# Altium project ME-TT-033.PrjPcb
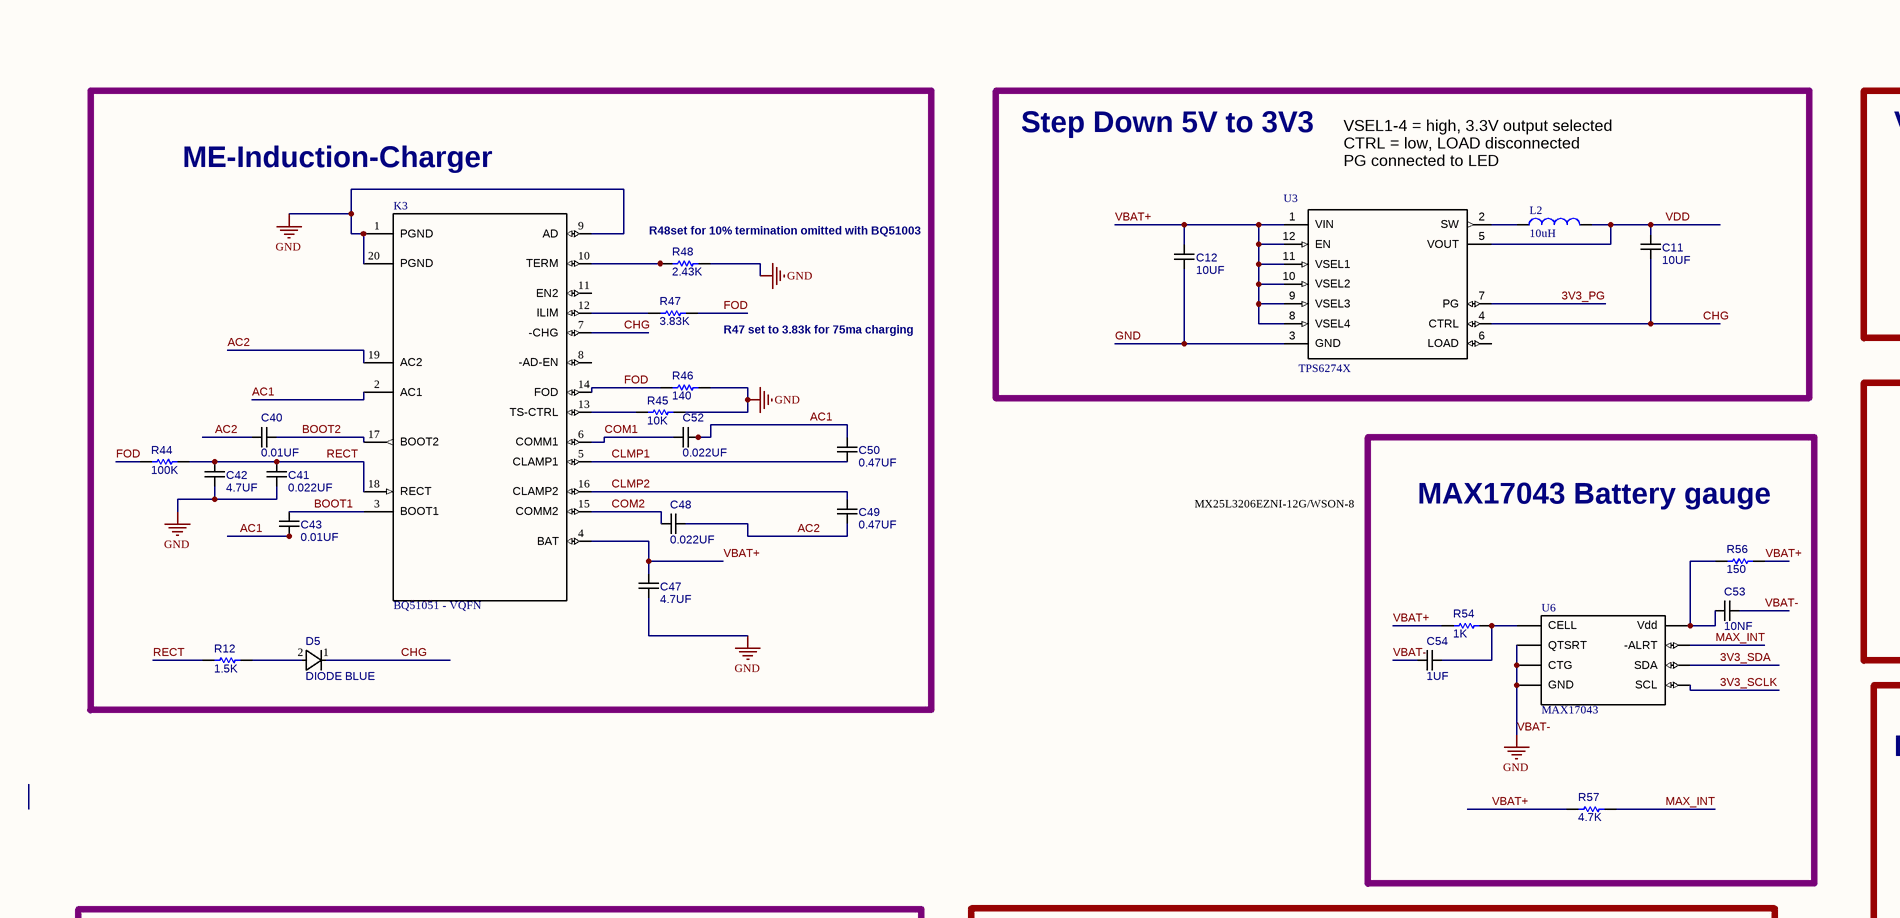
[diagram p0: Flytta-33.SchDoc, top left]
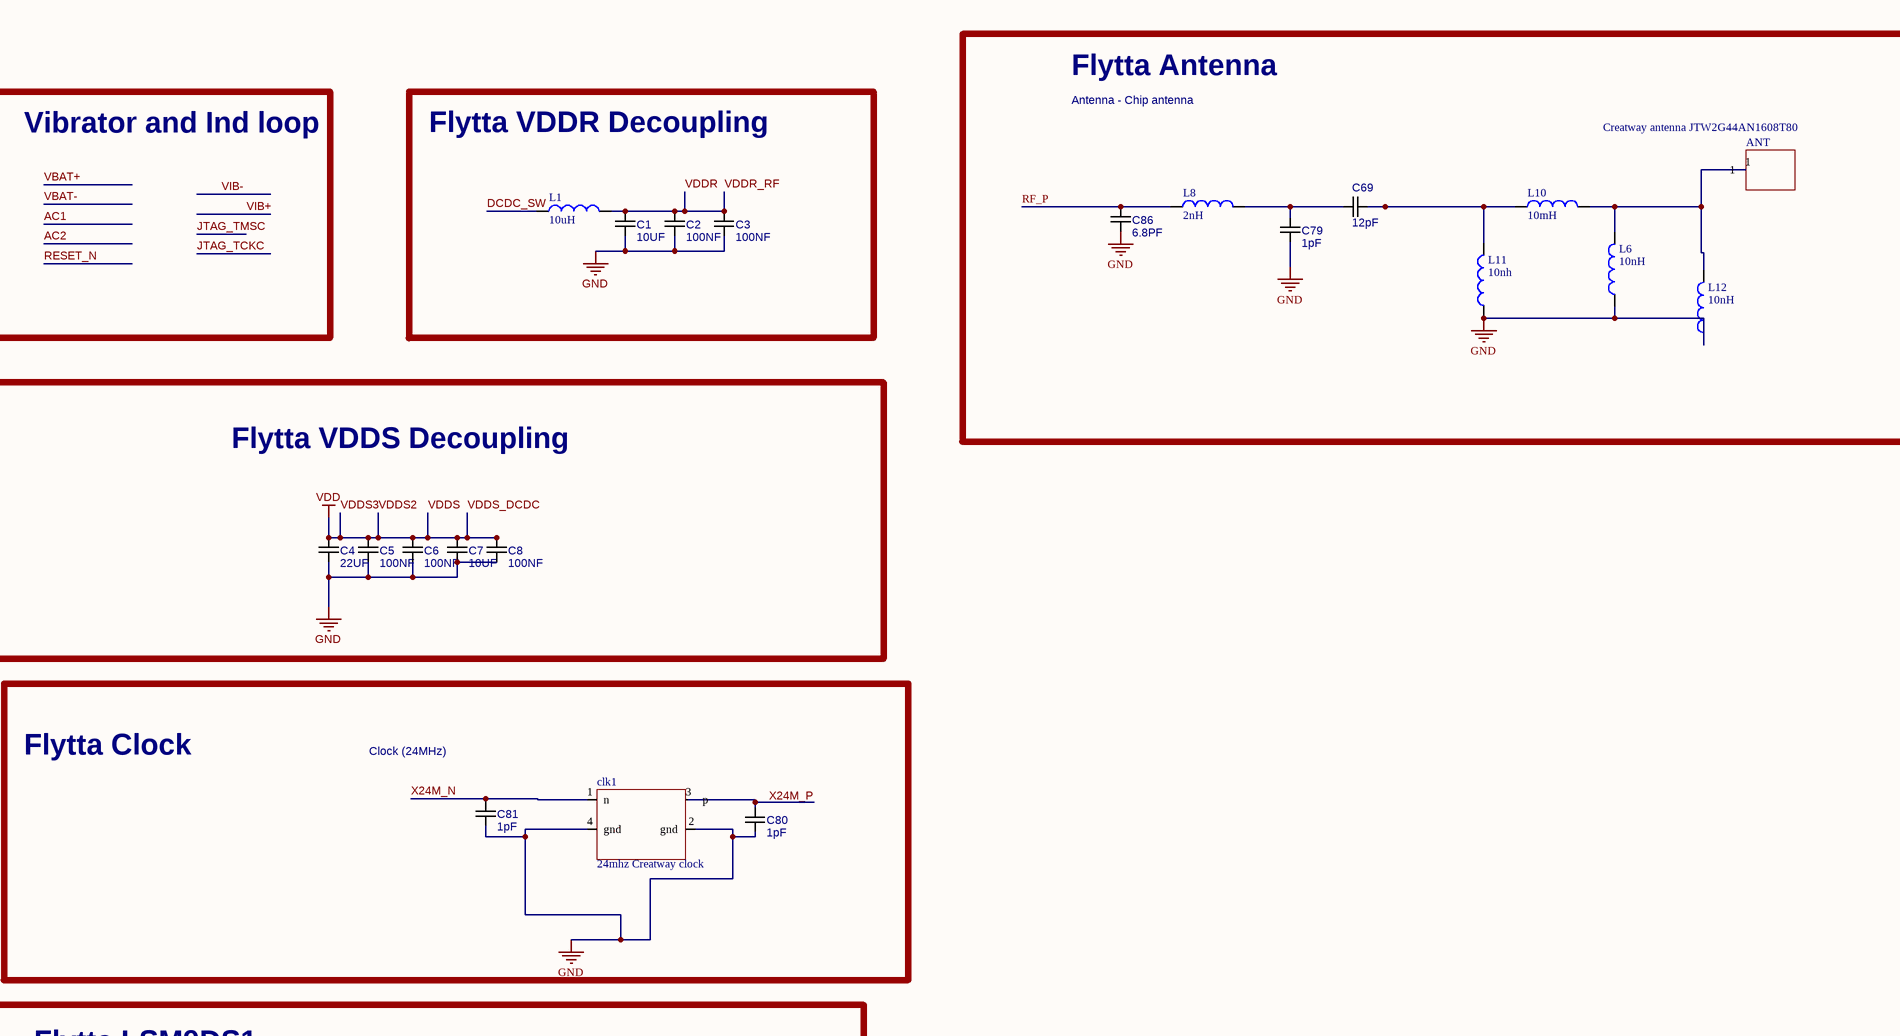
[diagram p1: Flytta-33.SchDoc, top right]
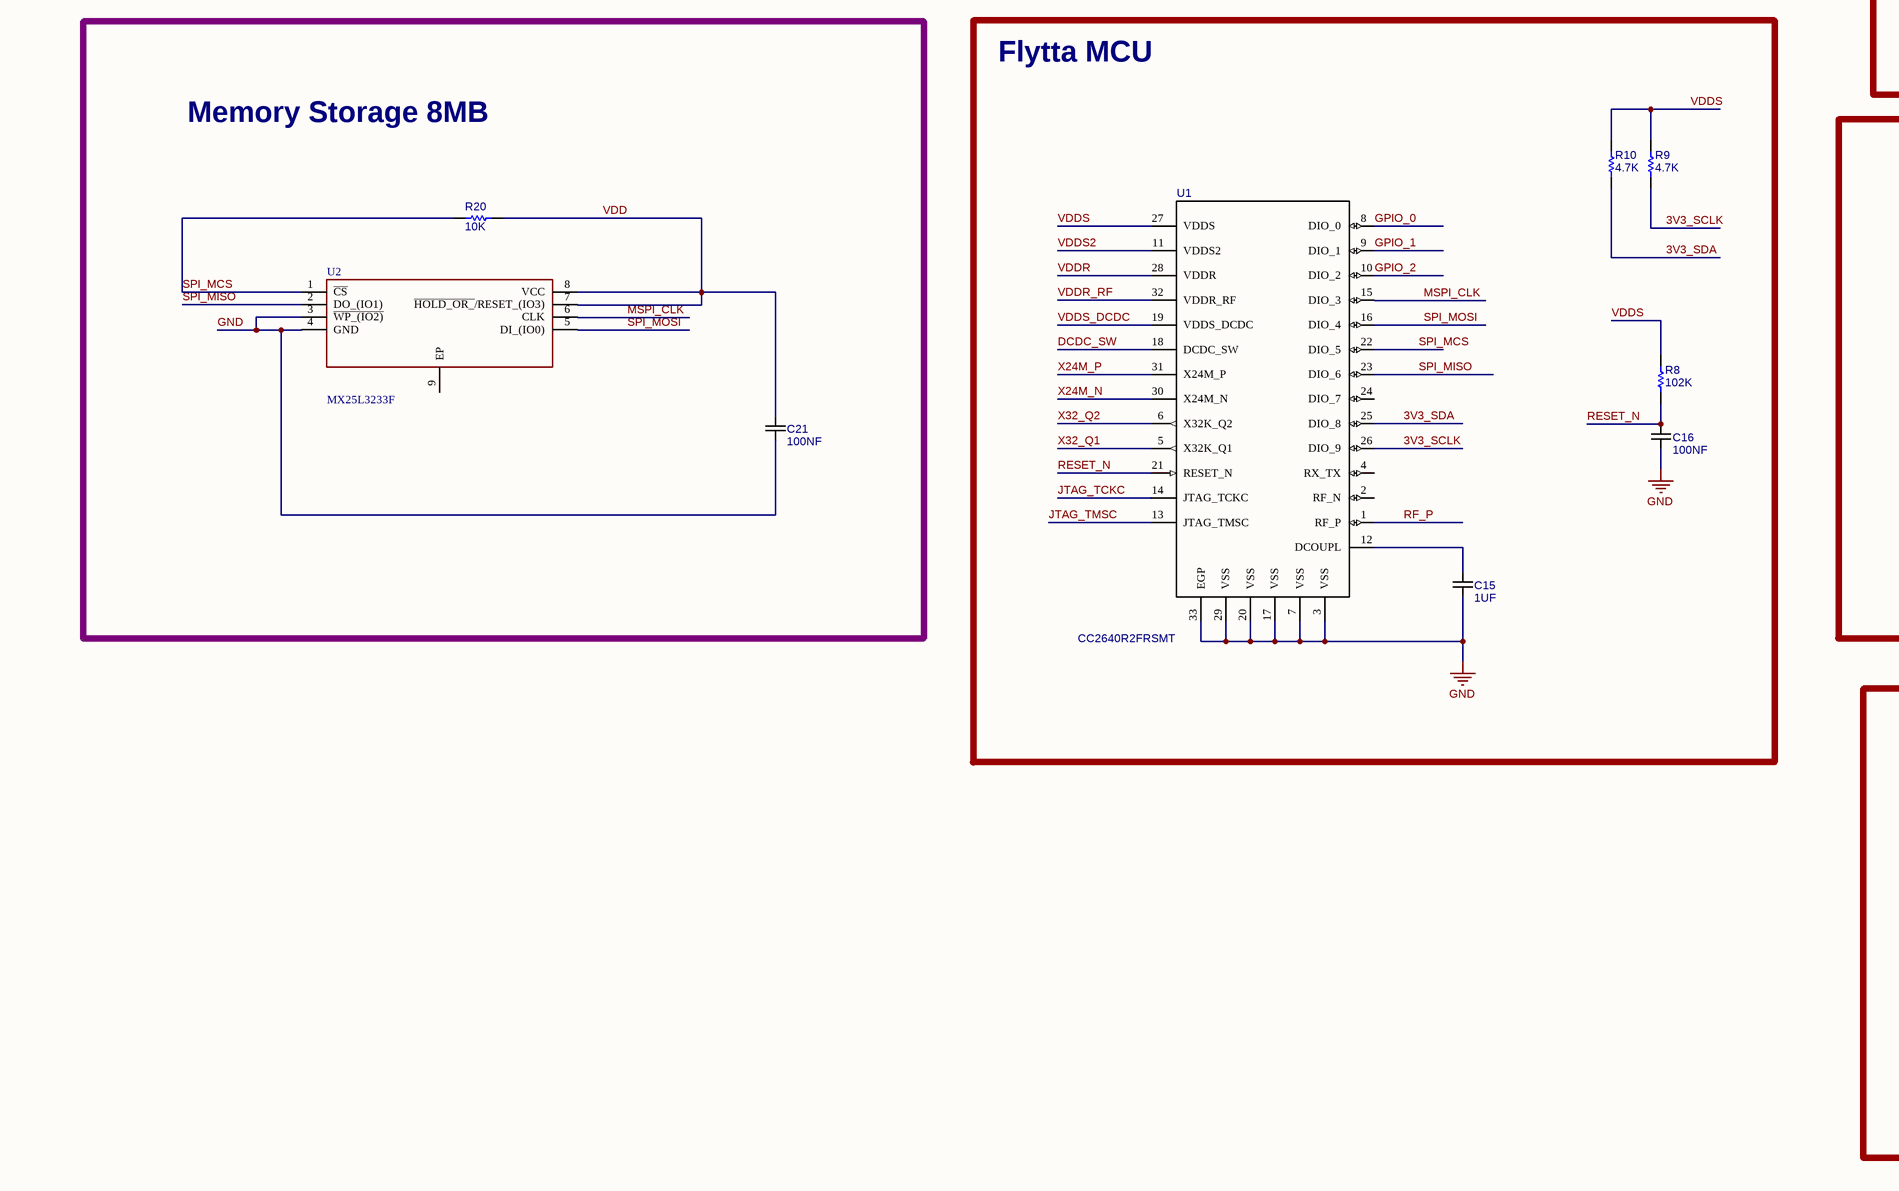
[diagram p2: Flytta-33.SchDoc, bottom left]
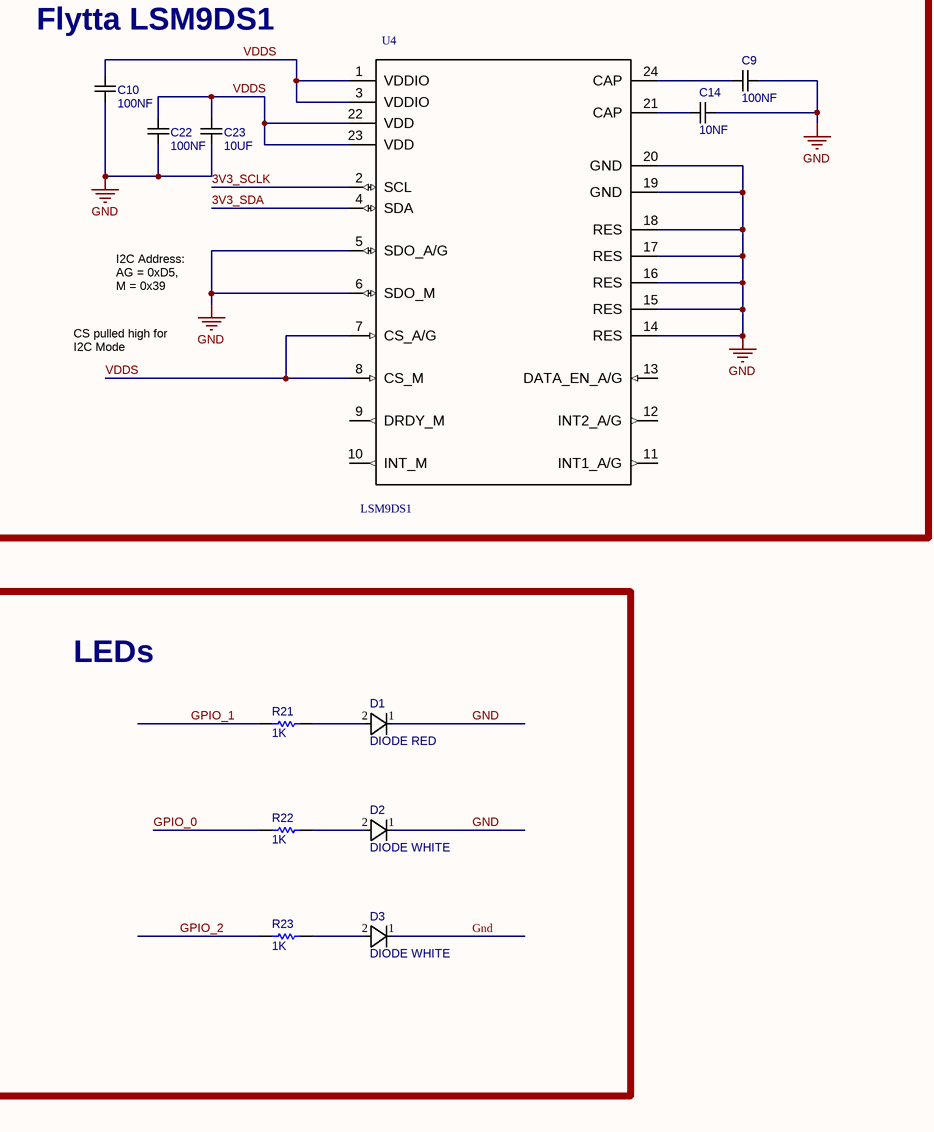
[diagram p3: Flytta-33.SchDoc, bottom right]
2 sheets, 140 parts. Net scope: global (net labels, ports and power ports of the same name join across sheets).
Board files: Flytta-33.PcbDoc, Flytta-34-old-ant.PcbDoc
Sheets:
  Flytta-33.SchDoc
  Flytta-34-old-ant.SchDoc

## Sheet Flytta-33.SchDoc
size A1

### Parts
(Parts that share a designator on the sheet are numbered #1, #2 ... from top to bottom, then left to right.)
ANT  Creatway antenna JTW2G44AN1608T80  [JTW2G44AN1608T80]
C1#1  10UF  [Passive (0402, 1005)]
C2#1  100NF  [Passive (0402, 1005)]
C3#1  100NF  [PASSIVE (0201, 0603)]
C4#1  22UF  [Passive (0603, 1608)]
C5#1  100NF  [PASSIVE (0201, 0603)]
C6#1  100NF  [PASSIVE (0201, 0603)]
C7#1  10UF  [Passive (0402, 1005)]
C8#1  100NF  [PASSIVE (0201, 0603)]
C9  100NF  [PASSIVE (0201, 0603)]
C10  100NF  [PASSIVE (0201, 0603)]
C11#1  10UF  [Passive (0402, 1005)]
C12#1  10UF  [Passive (0402, 1005)]  (net tie)
C14  10NF  [PASSIVE (0201, 0603)]
C15#1  1UF  [PASSIVE (0201, 0603)]
C16#1  100NF  [PASSIVE (0201, 0603)]
C21#1  100NF  [PASSIVE (0201, 0603)]
C22  100NF  [PASSIVE (0201, 0603)]
C23  10UF  [Passive (0402, 1005)]
C40#1  0.01UF  [PASSIVE (0201, 0603)]
C41#1  0.022UF  [PASSIVE (0201, 0603)]
C42#1  4.7UF  [PASSIVE (0201, 0603)]
C43#1  0.01UF  [PASSIVE (0201, 0603)]
C47#1  4.7UF  [PASSIVE (0201, 0603)]
C48#1  0.022UF  [PASSIVE (0201, 0603)]
C49#1  0.47UF  [PASSIVE (0201, 0603)]
C50#1  0.47UF  [PASSIVE (0201, 0603)]
C52#1  0.022UF  [PASSIVE (0201, 0603)]
C53#1  10NF  [PASSIVE (0201, 0603)]
C54#1  1UF  [PASSIVE (0201, 0603)]
C69#1  12pF  [Passive (0402, 1005)]
C79#1  1pF  [Passive (0402, 1005)]
C80#1  1pF  [Passive (0402, 1005)]
C81#1  1pF  [Passive (0402, 1005)]
C86#1  6.8PF  [Passive (0402, 1005)]
clk1#1  24mhz Creatway clock  [24mhz creatway clock]
D1#1  DIODE RED  [Diode]
D2#1  DIODE WHITE  [Diode]
D3#1  DIODE WHITE  [Diode]
D5#1  DIODE BLUE  [Diode]
K3#1  BQ51051 - VQFN  [bq51051 - vqfn]
L1#1  10uH  [Passive (0603, 1608)]
L2#1  10uH  [Passive (0603, 1608)]
L6  10nH  [Passive (0603, 1608)]
L8#1  2nH  [Passive (0402, 1005)]
L10  10mH  [Passive (0603, 1608)]
L11  10nh  [Passive (0603, 1608)]
L12  10nH  [Passive (0603, 1608)]
R8#1  102K  [PASSIVE (0201, 0603)]
R9#1  4.7K  [PASSIVE (0201, 0603)]
R10#1  4.7K  [PASSIVE (0201, 0603)]
R12#1  1.5K  [PASSIVE (0201, 0603)]
R20#1  10K  [PASSIVE (0201, 0603)]
R21#1  1K  [PASSIVE (0201, 0603)]
R22#1  1K  [PASSIVE (0201, 0603)]
R23#1  1K  [PASSIVE (0201, 0603)]
R44#1  100K  [PASSIVE (0201, 0603)]
R45#1  10K  [PASSIVE (0201, 0603)]
R46#1  140  [PASSIVE (0201, 0603)]
R47#1  3.83K  [PASSIVE (0201, 0603)]
R48#1  2.43K  [PASSIVE (0201, 0603)]
R54#1  1K  [PASSIVE (0201, 0603)]
R56#1  150  [PASSIVE (0201, 0603)]
R57#1  4.7K  [PASSIVE (0201, 0603)]
U1#1  CC2640R2FRSMT  [RSM0032B]
U2#1  MX25L3233F  [MX25L32]
U3#1  TPS6274X  [TPS6274]
U4  LSM9DS1  [LSM9DS1]
U6#1  MAX17043  [MAX17043]

### Blocks framed on the sheet
Flytta Antenna: ANT C69#1 C79#1 C86#1 L6 L8#1 L10-L12
ME-Induction-Charger: C40#1 C41#1 C42#1 C43#1 C47#1 C48#1 C49#1 C50#1 C52#1 D5#1 K3#1 R12#1 R44#1 R45#1 R46#1 R47#1 R48#1
Step Down 5V to 3V3: C11#1 C12#1 L2#1 U3#1
Flytta VDDR Decoupling: C1#1 C2#1 C3#1 L1#1
Flytta VDDS Decoupling: C4#1 C5#1 C6#1 C7#1 C8#1
MAX17043 Battery gauge: C53#1 C54#1 R54#1 R56#1 R57#1 U6#1
Flytta Clock: C80#1 C81#1 clk1#1
Memory Storage 8MB: C21#1 R20#1 U2#1
Flytta MCU: C15#1 C16#1 R8#1 R9#1 R10#1 U1#1
Flytta LSM9DS1: C9 C10 C14 C22 C23 U4
LEDs: D1#1 D2#1 D3#1 R21#1 R22#1 R23#1

### Nets
GND: C1#1.1 C2#1.1 C3#1.1 C4#1.1 C5#1.1 C6#1.1 C7#1.1 C8#1.1 C9.1 C10.2 C12#1.1 C14.1 C15#1.1 C16#1.1 C21#1.2 C22.1 C23.1 C41#1.2 C42#1.2 C47#1.2 C53#1.2 C54#1.1 C79#1.1 C80#1.1 C81#1.1 C86#1.1 clk1#1.2(gnd) clk1#1.4(gnd) D1#1.1 D2#1.1 D3#1.1 K3#1.1(PGND) K3#1.9(AD) K3#1.20(PGND) L6.1 L11.1 L12.1 R45#1.1 R46#1.1 R48#1.1 U1#1.3(VSS) U1#1.7(VSS) U1#1.17(VSS) U1#1.20(VSS) U1#1.29(VSS) U1#1.33(EGP) U2#1.3(~{WP_(IO2)}) U2#1.4(GND) U3#1.3(GND) U4.5(SDO_A/G) U4.6(SDO_M) U4.14(RES) U4.15(RES) U4.16(RES) U4.17(RES) U4.18(RES) U4.19(GND) U4.20(GND) U6#1.A3(CTG) U6#1.B1(QTSRT) U6#1.C3(GND)  [also labelled VBAT-]
VDD: C4#1.2 C5#1.2 C6#1.2 C7#1.2 C8#1.2 C10.1 C11#1.2 C21#1.1 C22.2 C23.2 L2#1.2 R8#1.2 R9#1.2 R10#1.2 R20#1.1 U1#1.11(VDDS2) U1#1.19(VDDS_DCDC) U1#1.27(VDDS) U2#1.7(~{HOLD_OR_}/RESET_(IO3)) U2#1.8(VCC) U3#1.5(VOUT) U4.1(VDDIO) U4.3(VDDIO) U4.7(CS_A/G) U4.8(CS_M) U4.22(VDD) U4.23(VDD)  [also labelled VDDS, VDDS2, VDDS3, VDDS_DCDC]
3V3_PG: U3#1.7(PG)
3V3_SCLK: R9#1.1 U1#1.26(DIO_9) U4.2(SCL) U6#1.A2(SCL)
3V3_SDA: R10#1.1 U1#1.25(DIO_8) U4.4(SDA) U6#1.A1(SDA)
AC1: C43#1.2 C50#1.1 C52#1.2 K3#1.2(AC1)
AC2: C40#1.2 C48#1.2 C49#1.2 K3#1.19(AC2)
BOOT1: C43#1.1 K3#1.3(BOOT1)
BOOT2: C40#1.1 K3#1.17(BOOT2)
CHG: C11#1.1 D5#1.1 K3#1.7(-CHG) U3#1.4(CTRL)
CLMP1: C50#1.2 K3#1.5(CLAMP1)
CLMP2: C49#1.1 K3#1.16(CLAMP2)
COM1: C52#1.1 K3#1.6(COMM1)
COM2: C48#1.1 K3#1.15(COMM2)
DCDC_SW: L1#1.1 U1#1.18(DCDC_SW)
FOD: K3#1.14(FOD) R44#1.2 R46#1.2 R47#1.1
GPIO_0: R22#1.2 U1#1.8(DIO_0)
GPIO_1: R21#1.2 U1#1.9(DIO_1)
GPIO_2: R23#1.2 U1#1.10(DIO_2)
JTAG_TCKC: U1#1.14(JTAG_TCKC)
JTAG_TMSC: U1#1.13(JTAG_TMSC)
MAX_INT: R57#1.1 U6#1.C1(-ALRT)
MSPI_CLK: U1#1.15(DIO_3) U2#1.6(CLK)
RECT: C41#1.1 C42#1.1 K3#1.18(RECT) R12#1.2 R44#1.1
RESET_N: C16#1.2 R8#1.1 U1#1.21(RESET_N)
RF_P: C86#1.2 L8#1.1 U1#1.1(RF_P)
SPI_MCS: R20#1.2 U1#1.22(DIO_5) U2#1.1(~{CS})
SPI_MISO: U1#1.23(DIO_6) U2#1.2(DO_(IO1))
SPI_MOSI: U1#1.16(DIO_4) U2#1.5(DI_(IO0))
VBAT+: C12#1.2 C47#1.1 K3#1.4(BAT) R54#1.2 R56#1.1 R57#1.2 U3#1.1(VIN) U3#1.8(VSEL4) U3#1.9(VSEL3) U3#1.10(VSEL2) U3#1.11(VSEL1) U3#1.12(EN)
VDDR: C1#1.2 C2#1.2 C3#1.2 L1#1.2 U1#1.28(VDDR) U1#1.32(VDDR_RF)  [also labelled VDDR_RF]
X24M_N: C81#1.2 clk1#1.1(n) U1#1.30(X24M_N)
X24M_P: U1#1.31(X24M_P)
X32_Q1: U1#1.5(X32K_Q1)
X32_Q2: U1#1.6(X32K_Q2)
NetANT_1: ANT.1 L6.2 L10.2 L12.2
NetC9_2: C9.2 U4.24(CAP)
NetC14_2: C14.2 U4.21(CAP)
NetC15#1_2: C15#1.2 U1#1.12(DCOUPL)
NetC53#1_1: C53#1.1 R56#1.2 U6#1.C2(Vdd)
NetC54#1_2: C54#1.2 R54#1.1 U6#1.B3(CELL)
NetC69#1_1: C69#1.1 L10.1 L11.2
NetC69#1_2: C69#1.2 C79#1.2 L8#1.2
NetD1#1_2: D1#1.2 R21#1.1
NetD2#1_2: D2#1.2 R22#1.1
NetD3#1_2: D3#1.2 R23#1.1
NetD5#1_2: D5#1.2 R12#1.1
NetK3#1_10: K3#1.10(TERM) R48#1.2
NetK3#1_12: K3#1.12(ILIM) R47#1.2
NetK3#1_13: K3#1.13(TS-CTRL) R45#1.2
NetL2#1_1: L2#1.1 U3#1.2(SW)

Not connected (* = marked no-connect by the designer): C80#1 2; clk1#1 3(p); K3#1 8(-AD-EN) 11(EN2); U1#1 2(RF_N) 4(RX_TX) 24(DIO_7); U2#1 9(EP); U3#1 6(LOAD); U4 9(DRDY_M) 10(INT_M) 11(INT1_A/G) 12(INT2_A/G) 13(DATA_EN_A/G)

### Notes on the sheet
- Antenna - Chip antenna
- VSEL1-4 = high, 3.3V output selected
  CTRL = low, LOAD disconnected
  PG connected to LED
- Vibrator and Ind loop
- (near R48#1) R48set for 10% termination omitted with BQ51003
- R47 set to 3.83k for 75ma charging
- MX25L3206EZNI-12G/WSON-8
- Clock (24MHz)
- I2C Address: AG = 0xD5, M = 0x39
- CS pulled high for I2C Mode
- Labels drawn without touching a wire or pin: X24M_P

### Library data of the parts
C1#1 C2#1 C3#1 C4#1 C5#1 C6#1 C7#1 C8#1 C9 C10 C11#1 C12#1 C14 C15#1 C16#1 C21#1 C22 C23 C40#1 C41#1 C42#1 C43#1 C47#1 C48#1 C49#1 C50#1 C52#1 C53#1 C54#1 C69#1 C79#1 C80#1 C81#1 C86#1 = Capacitor: Ceramic chip capacitor; Value: *
D1#1 = DIODE: VLMW1500 - WHITE
D2#1 = DIODE: VLMW1500 - RED
D3#1 = DIODE: VLMW1500 -WHITE
D5#1 = DIODE: VLMW1500 -BLUE
L1#1 L2#1 L6 L8#1 L11 L12 = Inductor: Code_IEC: 1005; Value: 10mH; Published: 8-Jun-2000; LatestRevisionDate: 29-May-2009; LatestRevisionNote: IPC-7351 Footprint Added.; PackageReference: 0402-A; Publisher: Altium Limited; PackageDescription: Chip Inductor; Code_JEITA: 0402
L10 = Inductor: Code_IEC: 1005; Published: 8-Jun-2000; LatestRevisionDate: 29-May-2009; LatestRevisionNote: IPC-7351 Footprint Added.; PackageReference: 0402-A; Publisher: Altium Limited; PackageDescription: Chip Inductor; Code_JEITA: 0402; Value: 10mH
R8#1 R9#1 R10#1 R12#1 R20#1 R21#1 R22#1 R23#1 R44#1 R45#1 R46#1 R47#1 R48#1 R54#1 R56#1 R57#1 = Resistor: Value: *
U1#1 = CC2650F128RSMT: CC26xx; Manufacturer: Texas Instruments; CompType: IC; PIN_COUNT: 33; Application_BuildNumber: *; PartNumber: CC2650F128RSMT; Alternate PartNumber: CC2650F128RSMT; PackageReference: RSM0032B; MountType: SMT; RoHS: Y; RefDes: RefDes; Type: DEV
U2#1 = MX25L32
U3#1 = TPS6274X: Step down converter
U4 = LSM9DS1: 9DOF, Accel, Gyro, Mag; MF: Microchip; MP: MCP73871-3CAI/ML; Availability: Good; Package: QFN-20 Microchip; Price: 1.56 USD; Value: *
U6#1 = MAX17043: I2C battery gauge

## Sheet Flytta-34-old-ant.SchDoc
size A1
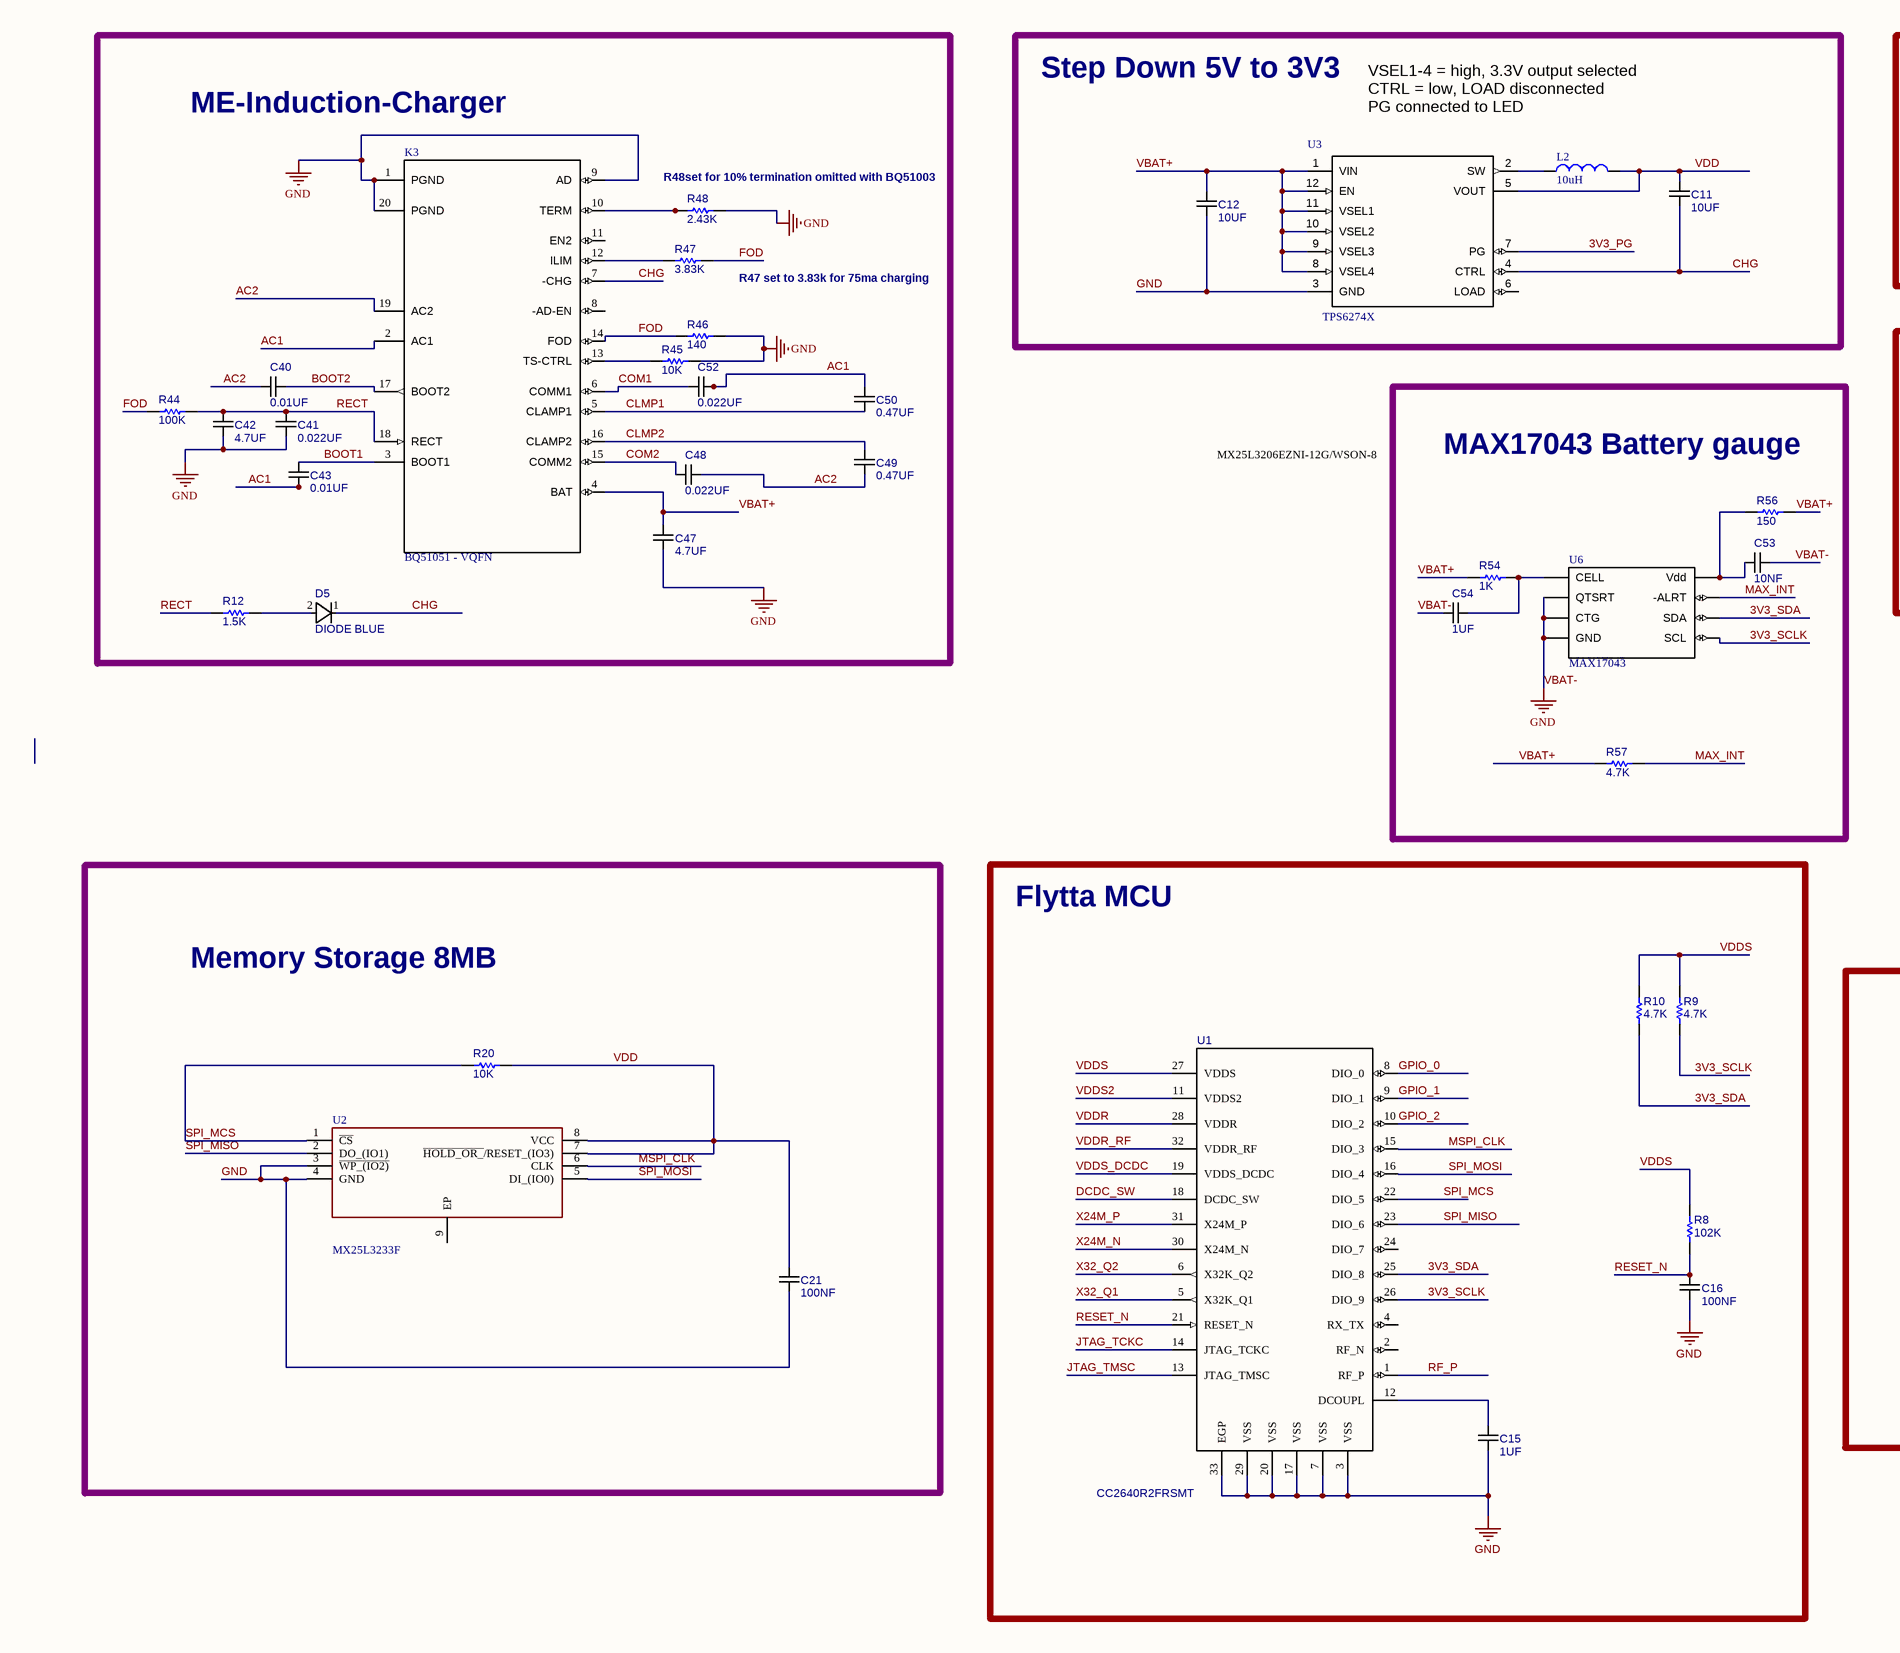
[diagram p4: Flytta-34-old-ant.SchDoc, left]
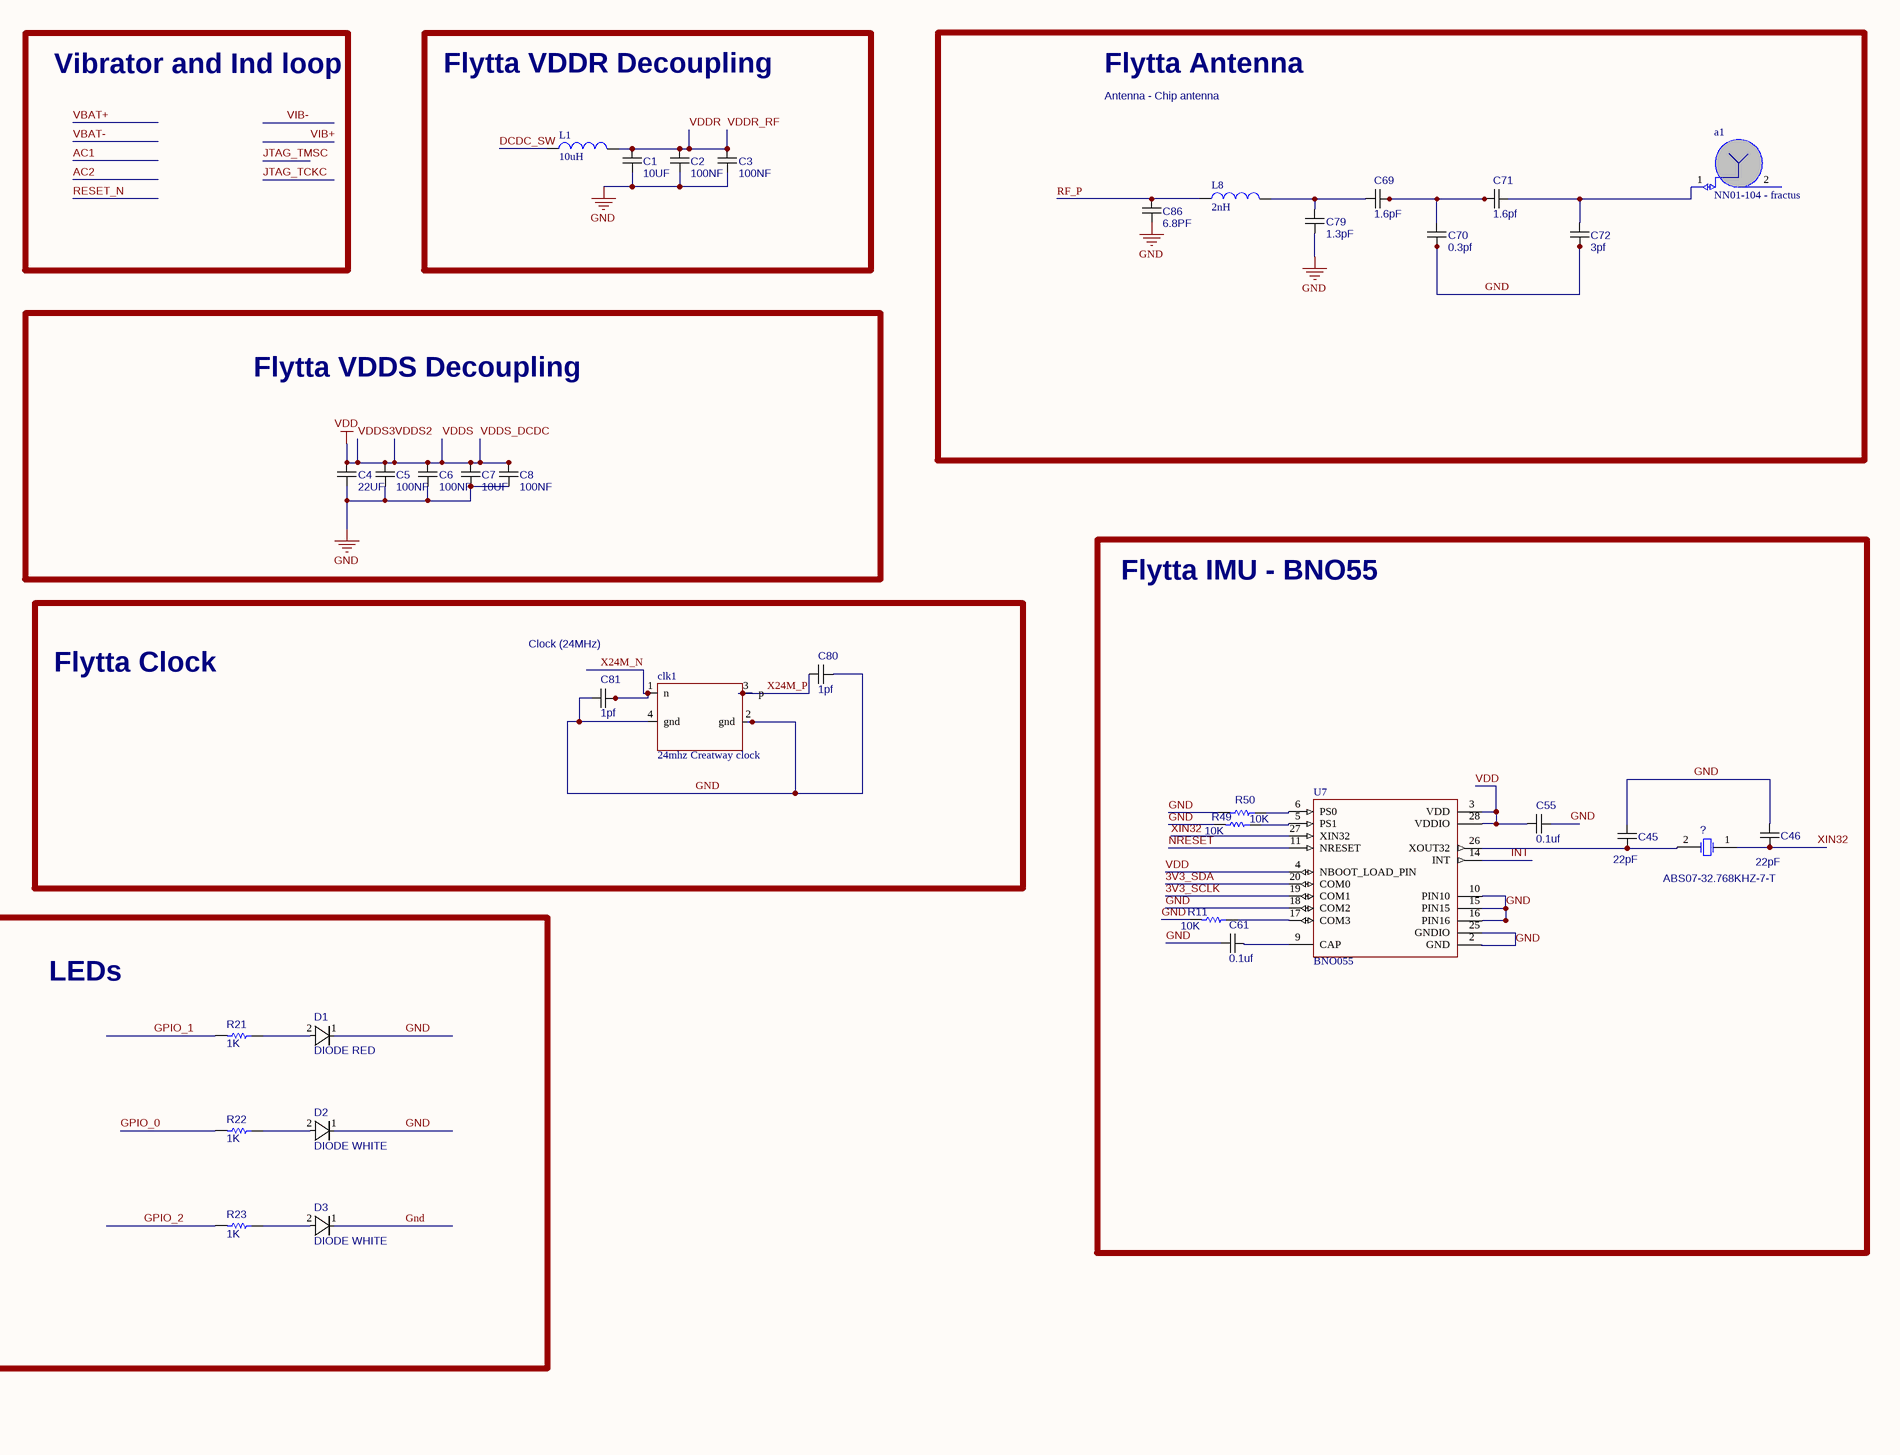
[diagram p5: Flytta-34-old-ant.SchDoc, right]

### Parts
(Parts that share a designator on the sheet are numbered #1, #2 ... from top to bottom, then left to right.)
?  ABS07-32.768KHZ-7-T  [ABS07]
a1  NN01-104 - fractus  [fractus-chip-antenna]
C1#2  10UF  [Passive (0402, 1005)]
C2#2  100NF  [Passive (0402, 1005)]
C3#2  100NF  [PASSIVE (0201, 0603)]
C4#2  22UF  [Passive (0603, 1608)]
C5#2  100NF  [PASSIVE (0201, 0603)]
C6#2  100NF  [PASSIVE (0201, 0603)]
C7#2  10UF  [Passive (0402, 1005)]
C8#2  100NF  [PASSIVE (0201, 0603)]
C11#2  10UF  [Passive (0402, 1005)]
C12#2  10UF  [Passive (0402, 1005)]  (net tie)
C15#2  1UF  [PASSIVE (0201, 0603)]
C16#2  100NF  [PASSIVE (0201, 0603)]
C21#2  100NF  [PASSIVE (0201, 0603)]
C40#2  0.01UF  [PASSIVE (0201, 0603)]
C41#2  0.022UF  [PASSIVE (0201, 0603)]
C42#2  4.7UF  [PASSIVE (0201, 0603)]
C43#2  0.01UF  [PASSIVE (0201, 0603)]
C45  22pF  [PASSIVE (0201, 0603)]
C46  22pF  [PASSIVE (0201, 0603)]
C47#2  4.7UF  [PASSIVE (0201, 0603)]
C48#2  0.022UF  [PASSIVE (0201, 0603)]
C49#2  0.47UF  [PASSIVE (0201, 0603)]
C50#2  0.47UF  [PASSIVE (0201, 0603)]
C52#2  0.022UF  [PASSIVE (0201, 0603)]
C53#2  10NF  [PASSIVE (0201, 0603)]
C54#2  1UF  [PASSIVE (0201, 0603)]
C55  0.1uf  [PASSIVE (0201, 0603)]
C61  0.1uf  [PASSIVE (0201, 0603)]
C69#2  1.6pF  [Passive (0402, 1005)]
C70  0.3pf  [Passive (0402, 1005)]
C71  1.6pf  [Passive (0402, 1005)]
C72  3pf  [Passive (0402, 1005)]
C79#2  1.3pF  [Passive (0402, 1005)]
C80#2  1pf  [Passive (0402, 1005)]
C81#2  1pf  [Passive (0402, 1005)]
C86#2  6.8PF  [Passive (0402, 1005)]
clk1#2  24mhz Creatway clock  [24mhz creatway clock]
D1#2  DIODE RED  [Diode]
D2#2  DIODE WHITE  [Diode]
D3#2  DIODE WHITE  [Diode]
D5#2  DIODE BLUE  [Diode]
K3#2  BQ51051 - VQFN  [bq51051 - vqfn]
L1#2  10uH  [Passive (0603, 1608)]
L2#2  10uH  [Passive (0603, 1608)]
L8#2  2nH  [Passive (0402, 1005)]
R8#2  102K  [PASSIVE (0201, 0603)]
R9#2  4.7K  [PASSIVE (0201, 0603)]
R10#2  4.7K  [PASSIVE (0201, 0603)]
R11  10K  [PASSIVE (0201, 0603)]
R12#2  1.5K  [PASSIVE (0201, 0603)]
R20#2  10K  [PASSIVE (0201, 0603)]
R21#2  1K  [PASSIVE (0201, 0603)]
R22#2  1K  [PASSIVE (0201, 0603)]
R23#2  1K  [PASSIVE (0201, 0603)]
R44#2  100K  [PASSIVE (0201, 0603)]
R45#2  10K  [PASSIVE (0201, 0603)]
R46#2  140  [PASSIVE (0201, 0603)]
R47#2  3.83K  [PASSIVE (0201, 0603)]
R48#2  2.43K  [PASSIVE (0201, 0603)]
R49  10K  [PASSIVE (0201, 0603)]
R50  10K  [PASSIVE (0201, 0603)]
R54#2  1K  [PASSIVE (0201, 0603)]
R56#2  150  [PASSIVE (0201, 0603)]
R57#2  4.7K  [PASSIVE (0201, 0603)]
U1#2  CC2640R2FRSMT  [RSM0032B]
U2#2  MX25L3233F  [MX25L32]
U3#2  TPS6274X  [TPS6274]
U6#2  MAX17043  [MAX17043]
U7  BNO055  [BNO055]

### Blocks framed on the sheet
ME-Induction-Charger: C40#2 C41#2 C42#2 C43#2 C47#2 C48#2 C49#2 C50#2 C52#2 D5#2 K3#2 R12#2 R44#2 R45#2 R46#2 R47#2 R48#2
Step Down 5V to 3V3: C11#2 C12#2 L2#2 U3#2
Flytta VDDR Decoupling: C1#2 C2#2 C3#2 L1#2
Flytta Antenna: a1 C69#2 C70-C72 C79#2 C86#2 L8#2
Flytta VDDS Decoupling: C4#2 C5#2 C6#2 C7#2 C8#2
MAX17043 Battery gauge: C53#2 C54#2 R54#2 R56#2 R57#2 U6#2
Flytta IMU - BNO55: ? C45 C46 C55 C61 R11 R49 R50 U7
Flytta Clock: C80#2 C81#2 clk1#2
Memory Storage 8MB: C21#2 R20#2 U2#2
Flytta MCU: C15#2 C16#2 R8#2 R9#2 R10#2 U1#2
LEDs: D1#2 D2#2 D3#2 R21#2 R22#2 R23#2

### Nets
GND: C1#2.1 C2#2.1 C3#2.1 C4#2.1 C5#2.1 C6#2.1 C7#2.1 C8#2.1 C12#2.1 C15#2.1 C16#2.1 C21#2.2 C41#2.2 C42#2.2 C45.2 C46.2 C47#2.2 C53#2.2 C54#2.1 C55.2 C61.2 C70.1 C72.1 C79#2.1 C80#2.2 C81#2.1 C86#2.1 clk1#2.2(gnd) clk1#2.4(gnd) D1#2.1 D2#2.1 D3#2.1 K3#2.1(PGND) K3#2.9(AD) K3#2.20(PGND) R11.2 R45#2.1 R46#2.1 R48#2.1 R49.2 R50.2 U1#2.3(VSS) U1#2.7(VSS) U1#2.17(VSS) U1#2.20(VSS) U1#2.29(VSS) U1#2.33(EGP) U2#2.3(~{WP_(IO2)}) U2#2.4(GND) U3#2.3(GND) U6#2.A3(CTG) U6#2.B1(QTSRT) U6#2.C3(GND) U7.2(GND) U7.10(PIN10) U7.15(PIN15) U7.16(PIN16) U7.18(COM2) U7.25(GNDIO)  [also labelled VBAT-]
VDD: C4#2.2 C5#2.2 C6#2.2 C7#2.2 C8#2.2 C11#2.2 C21#2.1 C55.1 L2#2.2 R8#2.2 R9#2.2 R10#2.2 R20#2.1 U1#2.11(VDDS2) U1#2.19(VDDS_DCDC) U1#2.27(VDDS) U2#2.7(~{HOLD_OR_}/RESET_(IO3)) U2#2.8(VCC) U3#2.5(VOUT) U7.3(VDD) U7.4(NBOOT_LOAD_PIN) U7.28(VDDIO)  [also labelled VDDS, VDDS2, VDDS3, VDDS_DCDC]
3V3_PG: U3#2.7(PG)
3V3_SCLK: R9#2.1 U1#2.26(DIO_9) U6#2.A2(SCL) U7.19(COM1)
3V3_SDA: R10#2.1 U1#2.25(DIO_8) U6#2.A1(SDA) U7.20(COM0)
AC1: C43#2.2 C50#2.1 C52#2.2 K3#2.2(AC1)
AC2: C40#2.2 C48#2.2 C49#2.2 K3#2.19(AC2)
BOOT1: C43#2.1 K3#2.3(BOOT1)
BOOT2: C40#2.1 K3#2.17(BOOT2)
CHG: C11#2.1 D5#2.1 K3#2.7(-CHG) U3#2.4(CTRL)
CLMP1: C50#2.2 K3#2.5(CLAMP1)
CLMP2: C49#2.1 K3#2.16(CLAMP2)
COM1: C52#2.1 K3#2.6(COMM1)
COM2: C48#2.1 K3#2.15(COMM2)
DCDC_SW: L1#2.1 U1#2.18(DCDC_SW)
FOD: K3#2.14(FOD) R44#2.2 R46#2.2 R47#2.1
GPIO_0: R22#2.2 U1#2.8(DIO_0)
GPIO_1: R21#2.2 U1#2.9(DIO_1)
GPIO_2: R23#2.2 U1#2.10(DIO_2)
INT: U7.14(INT)
JTAG_TCKC: U1#2.14(JTAG_TCKC)
JTAG_TMSC: U1#2.13(JTAG_TMSC)
MAX_INT: R57#2.1 U6#2.C1(-ALRT)
MSPI_CLK: U1#2.15(DIO_3) U2#2.6(CLK)
NRESET: U7.11(NRESET)
RECT: C41#2.1 C42#2.1 K3#2.18(RECT) R12#2.2 R44#2.1
RESET_N: C16#2.2 R8#2.1 U1#2.21(RESET_N)
RF_P: C86#2.2 L8#2.1 U1#2.1(RF_P)
SPI_MCS: R20#2.2 U1#2.22(DIO_5) U2#2.1(~{CS})
SPI_MISO: U1#2.23(DIO_6) U2#2.2(DO_(IO1))
SPI_MOSI: U1#2.16(DIO_4) U2#2.5(DI_(IO0))
VBAT+: C12#2.2 C47#2.1 K3#2.4(BAT) R54#2.2 R56#2.1 R57#2.2 U3#2.1(VIN) U3#2.8(VSEL4) U3#2.9(VSEL3) U3#2.10(VSEL2) U3#2.11(VSEL1) U3#2.12(EN)
VDDR: C1#2.2 C2#2.2 C3#2.2 L1#2.2 U1#2.28(VDDR) U1#2.32(VDDR_RF)  [also labelled VDDR_RF]
X24M_N: C81#2.2 clk1#2.1(n) U1#2.30(X24M_N)
X24M_P: C80#2.1 clk1#2.3(p) U1#2.31(X24M_P)
X32_Q1: U1#2.5(X32K_Q1)
X32_Q2: U1#2.6(X32K_Q2)
XIN32: ?.1(OSC1) C46.1 U7.27(XIN32)
Net?_2: ?.2(OSC2) C45.1 U7.26(XOUT32)
Neta1_1: a1.1(FEED1) C71.1 C72.2
NetC15#2_2: C15#2.2 U1#2.12(DCOUPL)
NetC53#2_1: C53#2.1 R56#2.2 U6#2.C2(Vdd)
NetC54#2_2: C54#2.2 R54#2.1 U6#2.B3(CELL)
NetC61_1: C61.1 U7.9(CAP)
NetC69#2_1: C69#2.1 C70.2 C71.2
NetC69#2_2: C69#2.2 C79#2.2 L8#2.2
NetD1#2_2: D1#2.2 R21#2.1
NetD2#2_2: D2#2.2 R22#2.1
NetD3#2_2: D3#2.2 R23#2.1
NetD5#2_2: D5#2.2 R12#2.1
NetK3#2_10: K3#2.10(TERM) R48#2.2
NetK3#2_12: K3#2.12(ILIM) R47#2.2
NetK3#2_13: K3#2.13(TS-CTRL) R45#2.2
NetL2#2_1: L2#2.1 U3#2.2(SW)
NetR11_1: R11.1 U7.17(COM3)
NetR49_1: R49.1 U7.5(PS1)
NetR50_1: R50.1 U7.6(PS0)

Not connected (* = marked no-connect by the designer): a1 2(GND); K3#2 8(-AD-EN) 11(EN2); U1#2 2(RF_N) 4(RX_TX) 24(DIO_7); U2#2 9(EP); U3#2 6(LOAD)

### Notes on the sheet
- VSEL1-4 = high, 3.3V output selected
  CTRL = low, LOAD disconnected
  PG connected to LED
- Vibrator and Ind loop
- Antenna - Chip antenna
- (near R48#2) R48set for 10% termination omitted with BQ51003
- R47 set to 3.83k for 75ma charging
- MX25L3206EZNI-12G/WSON-8
- Clock (24MHz)

### Library data of the parts
? = ABS07-32.768KHZ-7-T: 32 kHz
a1 = fractus-chip-antenna: NN01-104
C1#2 C2#2 C3#2 C4#2 C5#2 C6#2 C7#2 C8#2 C11#2 C12#2 C15#2 C16#2 C21#2 C40#2 C41#2 C42#2 C43#2 C45 C46 C47#2 C48#2 C49#2 C50#2 C52#2 C53#2 C54#2 C55 C61 C69#2 C70-C72 C79#2 C80#2 C81#2 C86#2 = Capacitor: Ceramic chip capacitor; Value: *
D1#2 = DIODE: VLMW1500 - WHITE
D2#2 = DIODE: VLMW1500 - RED
D3#2 = DIODE: VLMW1500 -WHITE
D5#2 = DIODE: VLMW1500 -BLUE
L1#2 L2#2 L8#2 = Inductor: Code_IEC: 1005; Value: 10mH; Published: 8-Jun-2000; LatestRevisionDate: 29-May-2009; LatestRevisionNote: IPC-7351 Footprint Added.; PackageReference: 0402-A; Publisher: Altium Limited; PackageDescription: Chip Inductor; Code_JEITA: 0402
R8#2 R9#2 R10#2 R11 R12#2 R20#2 R21#2 R22#2 R23#2 R44#2 R45#2 R46#2 R47#2 R48#2 R49 R50 R54#2 R56#2 R57#2 = Resistor: Value: *
U1#2 = CC2650F128RSMT: as U1#1 on sheet Flytta-33; Application_BuildNumber: *; PartNumber: CC2650F128RSMT; Alternate PartNumber: CC2650F128RSMT; PackageReference: RSM0032B; MountType: SMT; RoHS: Y; RefDes: RefDes; Type: DEV
U2#2 = MX25L32
U3#2 = TPS6274X: Step down converter
U6#2 = MAX17043: I2C battery gauge

## Nets that join several sheets
GND: Flytta-33 (61 pins), Flytta-34-old-ant (59 pins)
VDD: Flytta-33 (27 pins), Flytta-34-old-ant (22 pins)
3V3_PG: Flytta-33 (U3#1.7), Flytta-34-old-ant (U3#2.7)
3V3_SCLK: Flytta-33 (R9#1.1 U1#1.26 U4.2 U6#1.A2), Flytta-34-old-ant (R9#2.1 U1#2.26 U6#2.A2 U7.19)
3V3_SDA: Flytta-33 (R10#1.1 U1#1.25 U4.4 U6#1.A1), Flytta-34-old-ant (R10#2.1 U1#2.25 U6#2.A1 U7.20)
AC1: Flytta-33 (C43#1.2 C50#1.1 C52#1.2 K3#1.2), Flytta-34-old-ant (C43#2.2 C50#2.1 C52#2.2 K3#2.2)
AC2: Flytta-33 (C40#1.2 C48#1.2 C49#1.2 K3#1.19), Flytta-34-old-ant (C40#2.2 C48#2.2 C49#2.2 K3#2.19)
BOOT1: Flytta-33 (C43#1.1 K3#1.3), Flytta-34-old-ant (C43#2.1 K3#2.3)
BOOT2: Flytta-33 (C40#1.1 K3#1.17), Flytta-34-old-ant (C40#2.1 K3#2.17)
CHG: Flytta-33 (C11#1.1 D5#1.1 K3#1.7 U3#1.4), Flytta-34-old-ant (C11#2.1 D5#2.1 K3#2.7 U3#2.4)
CLMP1: Flytta-33 (C50#1.2 K3#1.5), Flytta-34-old-ant (C50#2.2 K3#2.5)
CLMP2: Flytta-33 (C49#1.1 K3#1.16), Flytta-34-old-ant (C49#2.1 K3#2.16)
COM1: Flytta-33 (C52#1.1 K3#1.6), Flytta-34-old-ant (C52#2.1 K3#2.6)
COM2: Flytta-33 (C48#1.1 K3#1.15), Flytta-34-old-ant (C48#2.1 K3#2.15)
DCDC_SW: Flytta-33 (L1#1.1 U1#1.18), Flytta-34-old-ant (L1#2.1 U1#2.18)
FOD: Flytta-33 (K3#1.14 R44#1.2 R46#1.2 R47#1.1), Flytta-34-old-ant (K3#2.14 R44#2.2 R46#2.2 R47#2.1)
GPIO_0: Flytta-33 (R22#1.2 U1#1.8), Flytta-34-old-ant (R22#2.2 U1#2.8)
GPIO_1: Flytta-33 (R21#1.2 U1#1.9), Flytta-34-old-ant (R21#2.2 U1#2.9)
GPIO_2: Flytta-33 (R23#1.2 U1#1.10), Flytta-34-old-ant (R23#2.2 U1#2.10)
JTAG_TCKC: Flytta-33 (U1#1.14), Flytta-34-old-ant (U1#2.14)
JTAG_TMSC: Flytta-33 (U1#1.13), Flytta-34-old-ant (U1#2.13)
MAX_INT: Flytta-33 (R57#1.1 U6#1.C1), Flytta-34-old-ant (R57#2.1 U6#2.C1)
MSPI_CLK: Flytta-33 (U1#1.15 U2#1.6), Flytta-34-old-ant (U1#2.15 U2#2.6)
RECT: Flytta-33 (5 pins), Flytta-34-old-ant (5 pins)
RESET_N: Flytta-33 (C16#1.2 R8#1.1 U1#1.21), Flytta-34-old-ant (C16#2.2 R8#2.1 U1#2.21)
RF_P: Flytta-33 (C86#1.2 L8#1.1 U1#1.1), Flytta-34-old-ant (C86#2.2 L8#2.1 U1#2.1)
SPI_MCS: Flytta-33 (R20#1.2 U1#1.22 U2#1.1), Flytta-34-old-ant (R20#2.2 U1#2.22 U2#2.1)
SPI_MISO: Flytta-33 (U1#1.23 U2#1.2), Flytta-34-old-ant (U1#2.23 U2#2.2)
SPI_MOSI: Flytta-33 (U1#1.16 U2#1.5), Flytta-34-old-ant (U1#2.16 U2#2.5)
VBAT+: Flytta-33 (12 pins), Flytta-34-old-ant (12 pins)
VDDR: Flytta-33 (6 pins), Flytta-34-old-ant (6 pins)
X24M_N: Flytta-33 (C81#1.2 clk1#1.1 U1#1.30), Flytta-34-old-ant (C81#2.2 clk1#2.1 U1#2.30)
X24M_P: Flytta-33 (U1#1.31), Flytta-34-old-ant (C80#2.1 clk1#2.3 U1#2.31)
X32_Q1: Flytta-33 (U1#1.5), Flytta-34-old-ant (U1#2.5)
X32_Q2: Flytta-33 (U1#1.6), Flytta-34-old-ant (U1#2.6)